# EAGLE design PINDetector (EAGLE 5.11)
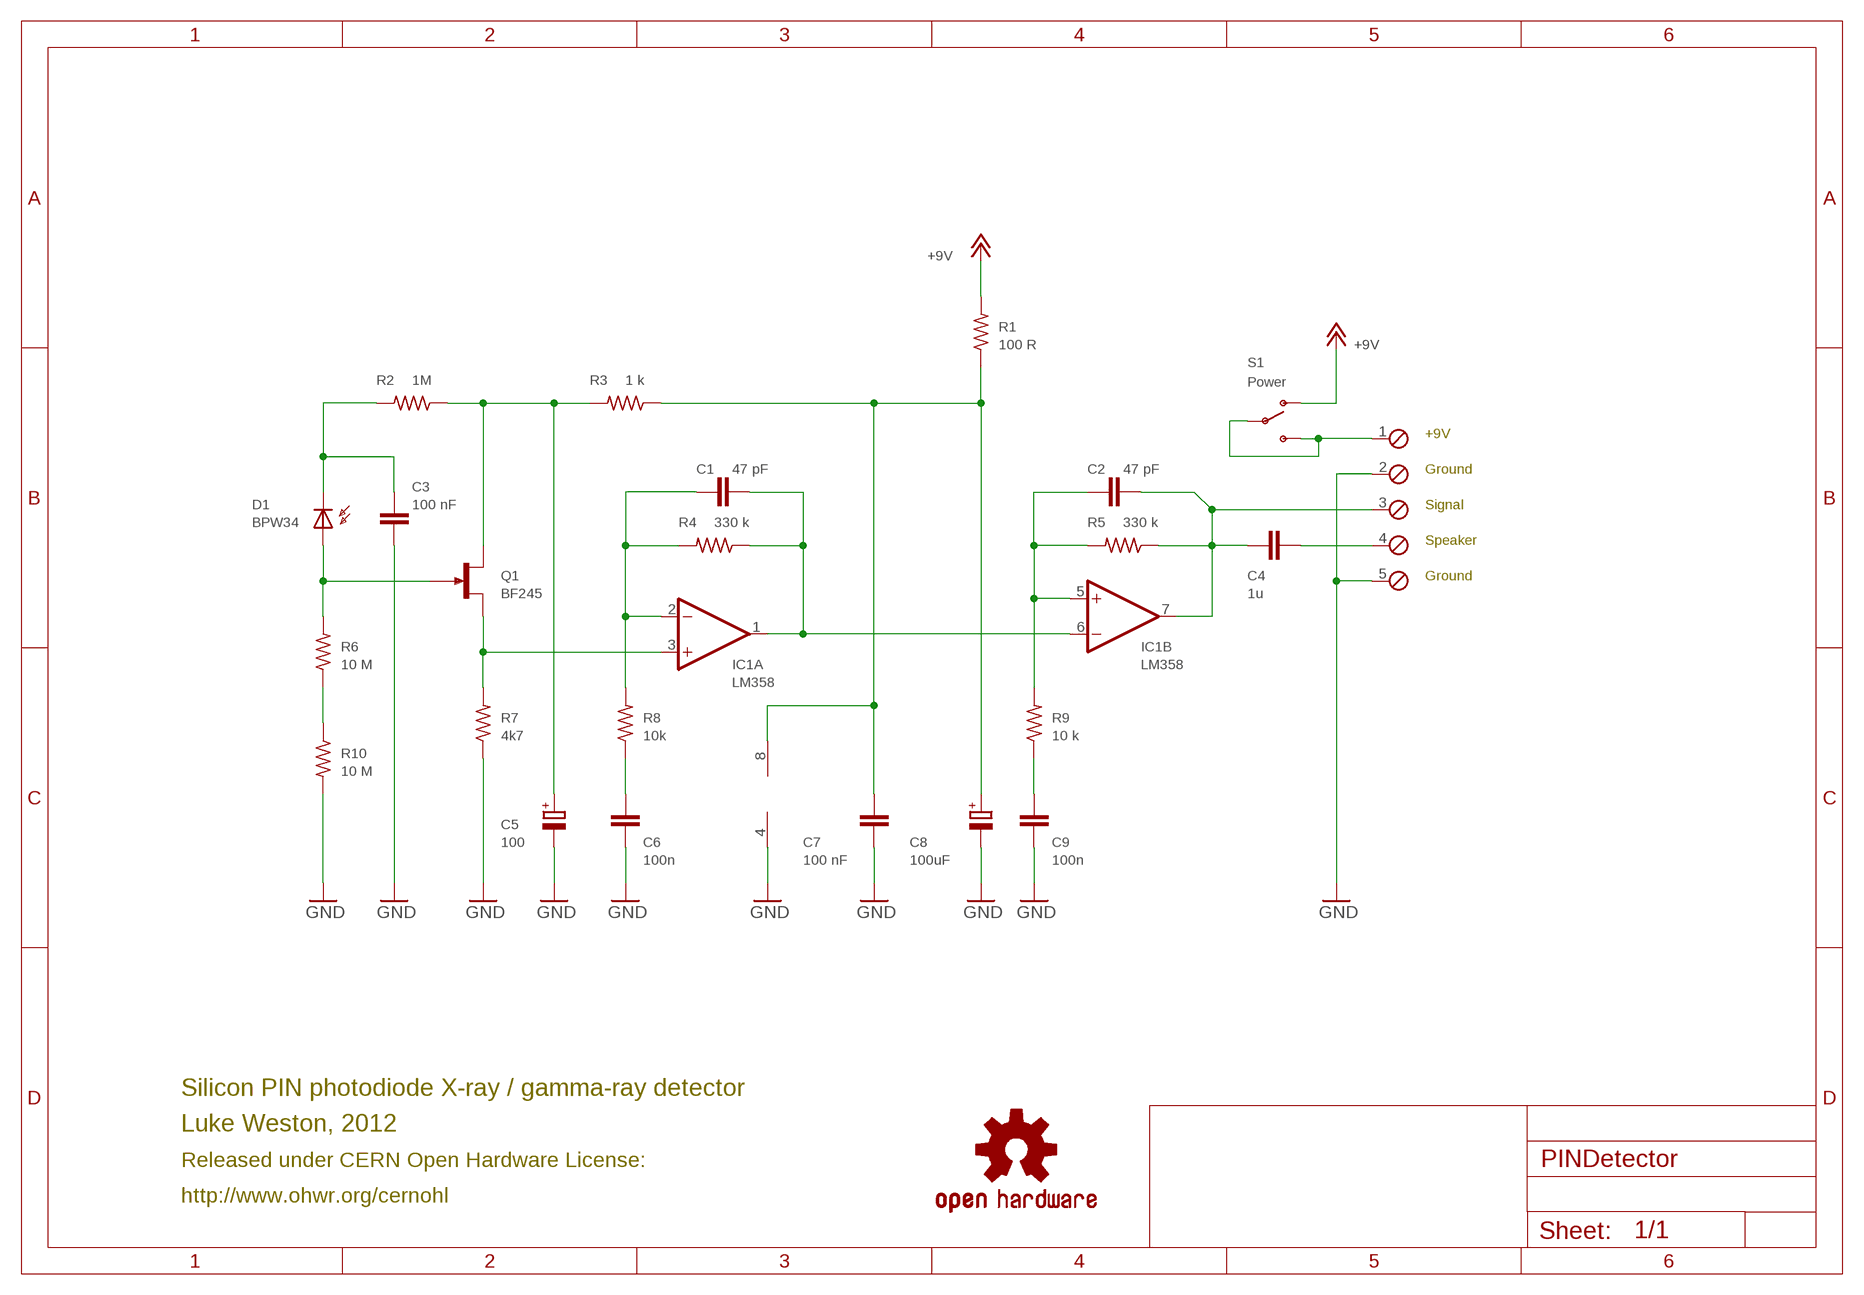
[diagram p0: schematic, sheet 1]

## Parts
C1  47 pF  C-EUC0805K  [C0805K]
C2  47 pF  C-EUC0805K  [C0805K]
C3  100 nF  C-EUC0805K  [C0805K]
C4  1u  C-EUC0805K  [C0805K]
C5  100  CPOL-EUSMCC  [SMC_C]
C6  100n  C-EUC0805K  [C0805K]
C7  100 nF  C-EUC0805K  [C0805K]
C8  100uF  CPOL-EUSMCC  [SMC_C]
C9  100n  C-EUC0805K  [C0805K]
D1  BPW34  BP104  [BP104]
IC1  LM358  LM358D  [SO08]
Q1  BF245  [SOT54C]
R1  100 R  R-US_M0805  [M0805]
R2  1M  R-US_M0805  [M0805]
R3  1 k  R-US_M0805  [M0805]
R4  330 k  R-US_M0805  [M0805]
R5  330 k  R-US_M0805  [M0805]
R6  10 M  R-US_M0805  [M0805]
R7  4k7  R-US_M0805  [M0805]
R8  10k  R-US_M0805  [M0805]
R9  10 k  R-US_M0805  [M0805]
R10  10 M  R-US_M0805  [M0805]
S1  Power  SWITCH-SPSTSMD2  [SWITCH-SPDT-SMD]
U$  OSHW-LOGOS  [OSHW-LOGO-S]
X1  foo  MPT5  [5POL254]

## Nets
+9V: R1.2 S1.1(O)
FOO: S1.2(P) S1.3(S) X1.1
GND: C3.2 C5.- C6.2 C7.2 C8.- C9.2 IC1.4(P:V-) R7.1 R10.2 X1.2 X1.5
N$1: D1.A Q1.G R6.2
N$2: R6.1 R10.1
N$3: C4.2 X1.4
N$4: C5.+ Q1.D R2.1 R3.2
N$5: IC1.3(A:+IN) Q1.S R7.2
N$6: C7.1 C8.+ IC1.8(P:V+) R1.1 R3.1
N$7: C1.1 IC1.2(A:-IN) R4.2 R8.2
N$9: C6.1 R8.1
N$10: C3.1 D1.K(C) R2.2
N$11: C2.1 IC1.5(B:+IN) R5.2 R9.2
N$12: C1.2 IC1.1(A:OUT) IC1.6(B:-IN) R4.1
N$14: C2.2 C4.1 IC1.7(B:OUT) R5.1 X1.3
N$15: C9.1 R9.1

## Notes on the sheet
- +9V
- Ground
- Signal
- Speaker
- Ground
- Silicon PIN photodiode X-ray / gamma-ray detector
- Luke Weston, 2012
- Released under CERN Open Hardware License:
- http://www.ohwr.org/cernohl

## Library data of the parts
C1-C4 C6 C7 C9 = resistor:C-EU: CAPACITOR, European symbol
C5 C8 = rcl:CPOL-EU: POLARIZED CAPACITOR, European symbol
D1 = opto-trans-siemens:BP104: PHOTO DIODE; MF: VISHAY/TELEFUNKEN; MPN: BP104; OC_FARNELL: 1779636; OC_NEWARK: 14M4504
IC1 = linear:LM358: OP AMP also LM158; LM258; LM2904 Source: http://cache.national.com/ds/LM/LM158.pdf
Q1 = transistor-small-signal:BF245: N-CHANNEL FET http://www.onsemi.com/pub/Collateral/BF245A-D.PDF
R1-R10 = resistor:R-US_: RESISTOR, American symbol
S1 = SparkFun:SWITCH-SPST: SPST Switch Simple slide switch. Spark Fun Electronics SKU : COM-00102
U$ = SparkFun:OSHW-LOGO: Open Source Hardware Logo This logo indicates the piece of hardware it is found on incorporates a OSHW license and/or adheres to the definition of open source hardware found here: http://freedomdefined.org/OSHW
X1 = con-phoenix-254:MPT5: PHOENIX CONNECTOR; OC_FARNELL: unknown; OC_NEWARK: unknown

## Board
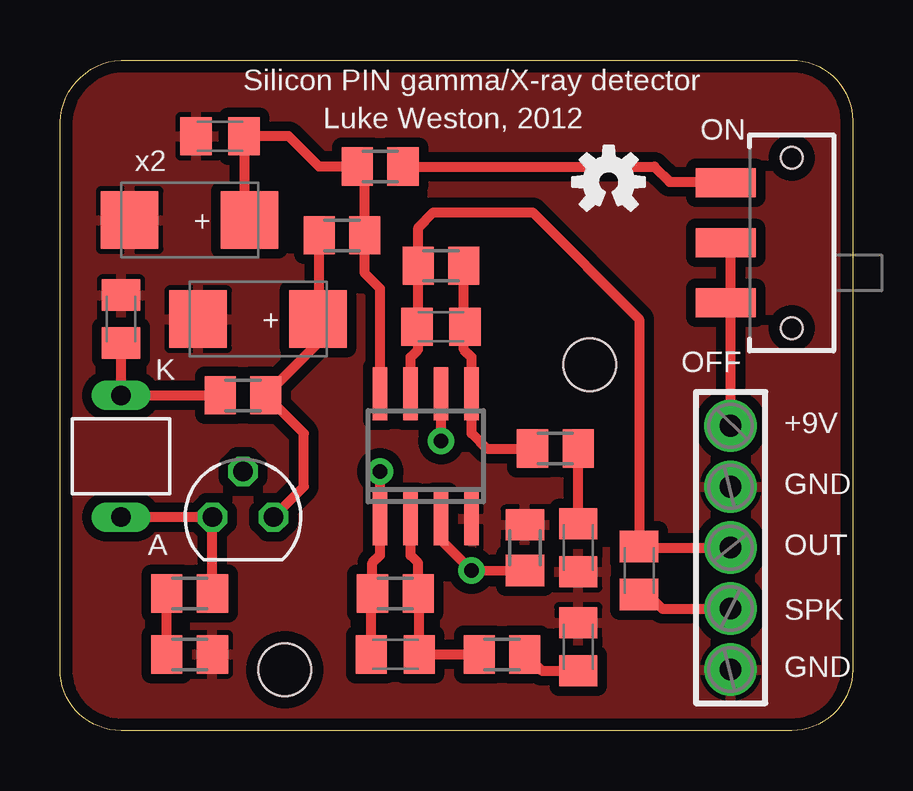
[diagram p1: board, top side]
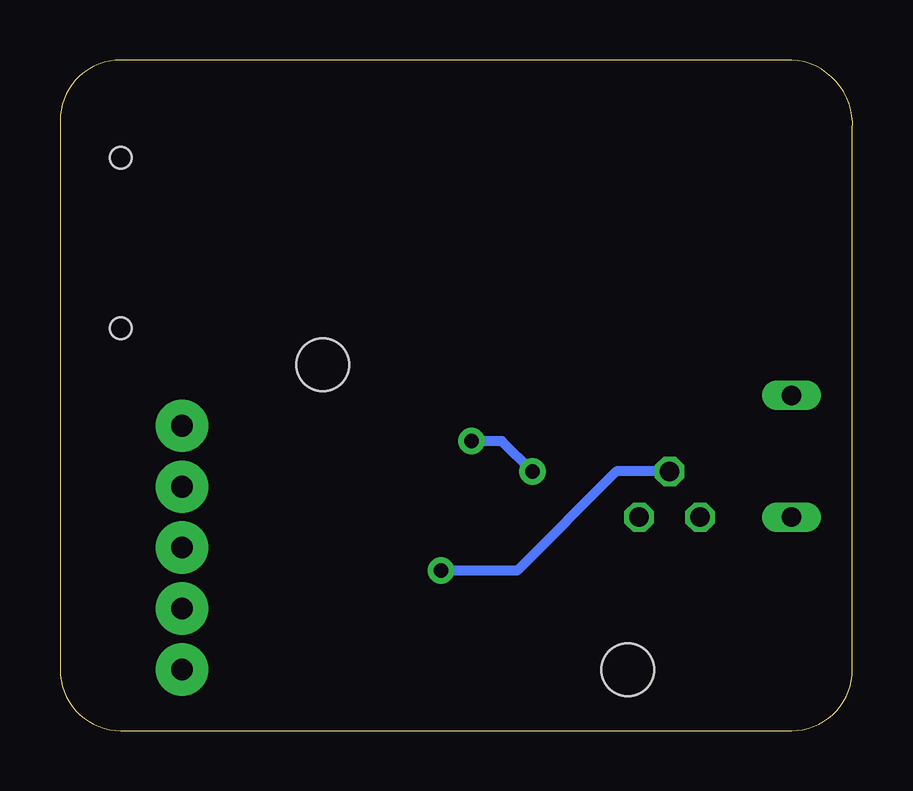
[diagram p2: board, bottom side, seen from below]

Size 33.02 x 27.94 mm. Coordinates in mm from the lower left corner, seen from the top.
Outline: 0,25.08 arc-90 2.54,27.94 30.48,27.94 arc-90 33.02,25.4 33.02,2.54 arc-90 30.48,0 2.54,0 arc-90 0,2.54 0,25.08
Copper layers (1*16): Top 0.035mm / dielectric 1.5mm / Bottom 0.035mm
Design rules "PCBCart-Standard": minimum track width 8mil, minimum drill 0.4mm, track to track 8mil, track to pad 8mil, pad to pad 8mil, via to via 8mil, smd to smd 8mil, copper to edge 20mil, drill to drill 8mil, minimum pad ring 8mil, minimum via ring 10mil, stop-mask expansion 3mil, vias tented up to drill 0mil, thermal gap 8mil
Holes 2.2 mm at 9.37,2.54 22.07,15.24

### Footprints (pad centres in the part's own frame; a part is rotated, then mirrored left to right if it is on the bottom)
C0805K = smd 1.3 x 1.6: 1 -1,0; 2 1,0
SMC_C = smd 2.4 x 2.4: + -2.5,0; - 2.5,0
BP104 = drill 0.813 long: A 0,2.54; K 0,-2.54
SO08 = smd 0.6 x 2.2: 1 -1.905,-2.6; 2 -0.635,-2.6; 3 0.635,-2.6; 4 1.905,-2.6; 5 1.905,2.6; 6 0.635,2.6; 7 -0.635,2.6; 8 -1.905,2.6
SOT54C = drill 0.813 octagon: D 1.27,0; G -1.27,0; S 0,1.905
M0805 = smd 1.3 x 1.6: 1 -0.95,0; 2 0.95,0
SWITCH-SPDT-SMD = smd 1.2 x 2.5: 1 -2.5,-2.75; 2 0,-2.75; 3 2.5,-2.75 | hole 0.9: -3.55,0; 3.55,0
5POL254 = drill 0.9 pad 2.184 round: 1 -5.08,0; 2 -2.54,0; 3 0,0; 4 2.54,0; 5 5.08,0

### Placement (x,y rotation side)
C1  13.97,3.17 180 top
C2  15.88,16.83 180 top
C3  2.54,17.14 90 top
C4  24.13,6.67 270 top
C5  8.26,17.14 180 top
C6  21.59,3.49 90 top
C7  6.67,24.77 180 top
C8  5.4,21.27 180 top
C9  21.59,7.62 270 top
D1  2.54,11.43 180 top
IC1  15.24,11.43 0 top
Q1  7.62,8.89 0 top
R1  13.34,23.5 0 top
R2  7.62,13.97 180 top
R3  11.75,20.64 180 top
R4  13.97,5.72 0 top
R5  15.88,19.37 0 top
R6  5.4,5.72 0 top
R7  19.37,7.62 270 top
R8  18.42,3.17 180 top
R9  20.64,11.75 180 top
R10  5.4,3.17 0 top
S1  30.48,20.32 270 top
U$  22.86,22.86 0 top
X1  27.94,7.62 270 top

### Tracks (layer width: path | path; a pad name or v marks a point on that pad's centre or on a via)
+9V
  Top 0.406: R1.2 24.77,23.5 25.4,22.86 27.69,22.86 S1.1
FOO
  Top 0.406: X1.1 27.94,17.78 | 27.94,17.78 27.94,20.11 S1.2 | S1.3 27.9,17.82 27.94,17.78
GND
  pour Top (isolate 0.406): -2.54,30.48 35.56,30.48 35.56,-2.54 -2.54,-2.54
N$1
  Top 0.406: D1.A Q1.G R6.2
N$2
  Top 0.406: R10.1 R6.1
N$3
  Top 0.406: X1.4 25.08,5.08 24.45,5.72 24.18,5.72 C4.2
N$4
  Top 0.406: Q1.D 10.16,10.16 10.16,12.38 R2.1 10.76,16.16 C5.+ 10.8,17.19 R3.2
N$5  (via drill 0.6)
  Top 0.406: IC1.3 15.88,7.94 v17.15,6.67 R7.2
  Bottom 0.406: v17.15,6.67 13.97,6.67 9.85,10.8 Q1.S
N$6
  Top 0.406: IC1.8 13.34,18.41 12.7,19.05 R3.1 12.7,23.18 R1.1 10.8,23.5 9.53,24.77 C7.1 7.67,21.5 C8.+
N$7
  Top 0.406: IC1.2 14.61,7.3 14.92,6.99 R4.2 14.97,5.67 C1.1 R8.2
N$9
  Top 0.406: C6.1 20.05,2.49 19.69,2.86 R8.1
N$10
  Top 0.406: R2.2 D1.K C3.1
N$11
  Top 0.406: R5.2 16.83,16.88 C2.1 16.83,16.78 16.83,15.88 17.15,15.56 IC1.5 17.15,12.38 17.78,11.75 R9.2
N$12  (via drill 0.6)
  Top 0.406: C1.2 12.97,5.67 R4.1 13.02,6.99 13.34,7.3 IC1.1 v13.34,10.8 | v15.88,12.07 IC1.6
  Bottom 0.406: v15.88,12.07 14.61,12.07 v13.34,10.8
N$14
  Top 0.406: IC1.7 14.61,15.56 14.92,15.88 14.92,16.78 C2.2 14.93,16.88 R5.1 14.93,20.96 15.56,21.59 19.69,21.59 24.13,17.14 C4.1 24.18,7.62 X1.3
N$15
  Top 0.406: C9.1 R9.1

### Text on the board
tPlace: Silicon PIN gamma/X-ray detector | Luke Weston, 2012 | ON | x2 | + | + | K | OFF | +9V | GND | A | OUT | SPK | GND